# EAGLE design onpoint (EAGLE 7.5.0)
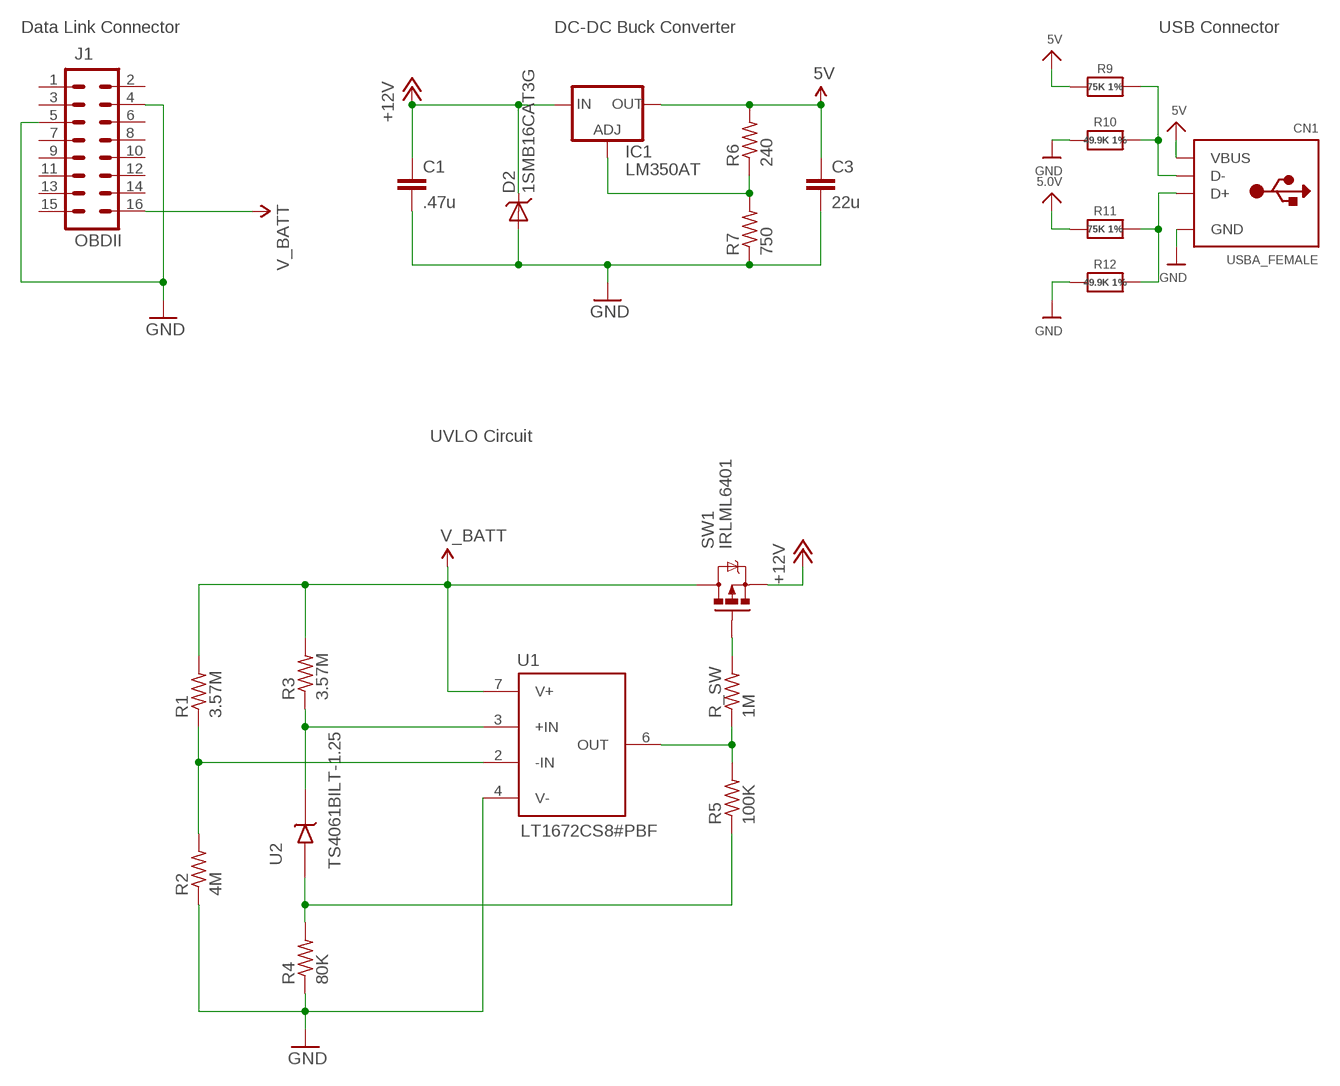
[diagram p0: schematic, sheet 1]

## Parts
C1  .47u  C-EUC0805  [C0805]
C3  22u  C-EUC0805  [C0805]
CN1  USBA_FEMALE  USB_TYPEAPTHFML  [USB_HOST-PTH]
D2  1SMB16CAT3G  DIODE-TVS-SMB  [SMB-DIODE]
IC1  LM350AT  V_REG_MIC2920  [SOT223]
J1  OBDII  M08X2STRAIGHT  [OBDII-STRAIGHT]
R1  3.57M  R-US_R0805  [R0805]
R2  4M  R-US_R0805  [R0805]
R3  3.57M  R-US_R0805  [R0805]
R4  80K  R-US_R0805  [R0805]
R5  100K  R-US_R0805  [R0805]
R6  240  R-US_R0805  [R0805]
R7  750  R-US_R0805  [R0805]
R9  75K 1%  RESISTOR0805_NOOUTLINE  [0805-NO]
R10  49.9K 1%  RESISTOR0805_NOOUTLINE  [0805-NO]
R11  75K 1%  RESISTOR0805_NOOUTLINE  [0805-NO]
R12  49.9K 1%  RESISTOR0805_NOOUTLINE  [0805-NO]
R_SW  1M  R-US_R0805  [R0805]
SW1  IRLML6401  MOSFET-PCHANNELIRLML2244  [SOT23-3]
U1  LT1672CS8#PBF  LT1672CS8#PBFSURFACE_MOUNT  [MSOP8]
U2  TS4061BILT-1.25  [SOT23-3L]

## Nets
5V: C3.1 CN1.VBUS IC1.3(OUT) R6.2 R9.2 R11.2 ; supply symbol labelled 5.0V
+12V: C1.1 D2.C IC1.1(IN) SW1.2(S)
D+: CN1.D+ R11.1 R12.1
D-: CN1.D- R9.1 R10.1
GND: C1.2 C3.2 CN1.GND D2.A J1.4 J1.5 R2.1 R4.1 R7.1 R10.2 R12.2 U1.4(V-)
N$1: IC1.2(GND) R6.1 R7.2
N$2: R5.2 R_SW.1 U1.6(OUT)
N$3: R3.1 U1.3(+IN) U2.1(K)
N$5: R1.1 R2.2 U1.2(-IN)
N$6: R_SW.2 SW1.1(G)
N$7: R4.2 R5.1 U2.2(A)
V_BATT: J1.16 R1.2 R3.2 SW1.3(D) U1.7(V+)
Unconnected: J1.1 J1.2 J1.3 J1.6 J1.7 J1.8 J1.9 J1.10 J1.11 J1.12 J1.13 J1.14 J1.15

## Notes on the sheet
- Data Link Connector | DC-DC Buck Converter | USB Connector
- UVLO Circuit

## Library data of the parts
C1 = rcl:C-EU: CAPACITOR, European symbol; PARTNO: C0805C474K5RACTU
C3 = rcl:C-EU: CAPACITOR, European symbol; PARTNO: GRM219R61A226MEA0D
CN1 = microbuilder:USB_TYPEA: USB - Type A Connectors Male types stick out and are inserted into a PC or matching females parts (these are the connectors used on USB Memory Sticks, etc.). Female parts are generally used for USB Host and accept a male-type connector. SMT - 4UCON: 10017 PTHFML - Digikey: 609-1045-ND, 4UCon: 05241 PCB - Use 2.0mm thick PCBs with this footprint
D2 = BUG:DIODE-TVS; PARTNO: 1SMB16CAT3G; ROLE: Overvoltage protection
IC1 = SparkFun-PowerIC:V_REG_MIC2920: MIC2920A (http://www.micrel.com/_PDF/mic2920.pdf) - 400mA output LDO Regulator
J1 = MuniRent:M08X2: .1" headers, two rows of 8 each; PARTNO: OBD-II
R1-R7 R_SW = rcl:R-US_: RESISTOR, American symbol
R9-R12 = microbuilder:RESISTOR: Resistors For new designs, use the packages preceded by an '_' character since they are more reliable: The following footprints should be used on most boards: _0402 - Standard footprint for regular board layouts _0603 - Standard footprint for regular board layouts _0805 - Standard footprint for regular board layouts _1206 - Standard footprint for regular board layouts For extremely tight-pitch boards where space is at a premium, the following 'micro-pitch' footprints can be used (smaller pads, no silkscreen outline, etc.): _0402MP - Micro-pitch footprint for very dense/compact boards _0603MP - Micro-pitch footprint for very dense/compact boards _0805MP - Micro-pitch footprint for very dense/compact boards _1206MP - Micro-pitch footprint for very dense/compact boards
SW1 = SparkFun-DiscreteSemi:MOSFET-PCHANNEL: Generic PMOSFET IRLML2244 - TRANS-11153 (SOT-23 -20V -4.3A) (1.Gate 2.Source 3.Drain) FQP27P06 - COM-10349 <http://www.sparkfun.com/products/10349> (TO-220 -60V -27A) (1.Gate 2.Source 3.Drain); PROD_ID: TRANS-11153
U1 = alanmond:LT1672CS8#PBF
U2 = alanmond:TS4061BILT-1.25: The TS4061 is a low power and high accuracy shunt voltage reference providing a stable output voltage over the industrial temperature range (-40 to +85 °C), with a maximum temperature coefficient of 35 ppm/°C. It is available in 0.1% and 0.2% initial accuracy versions. The SOT323- 3L and SOT23-3L packages can be designed in applications where space saving is a critical issue. The very low operating current is a key advantage for power restricted designs. The TS4061 is very stable and can be used in a broad range of application conditions.

## Net classes
0 default: width 0.254 mm

## Board
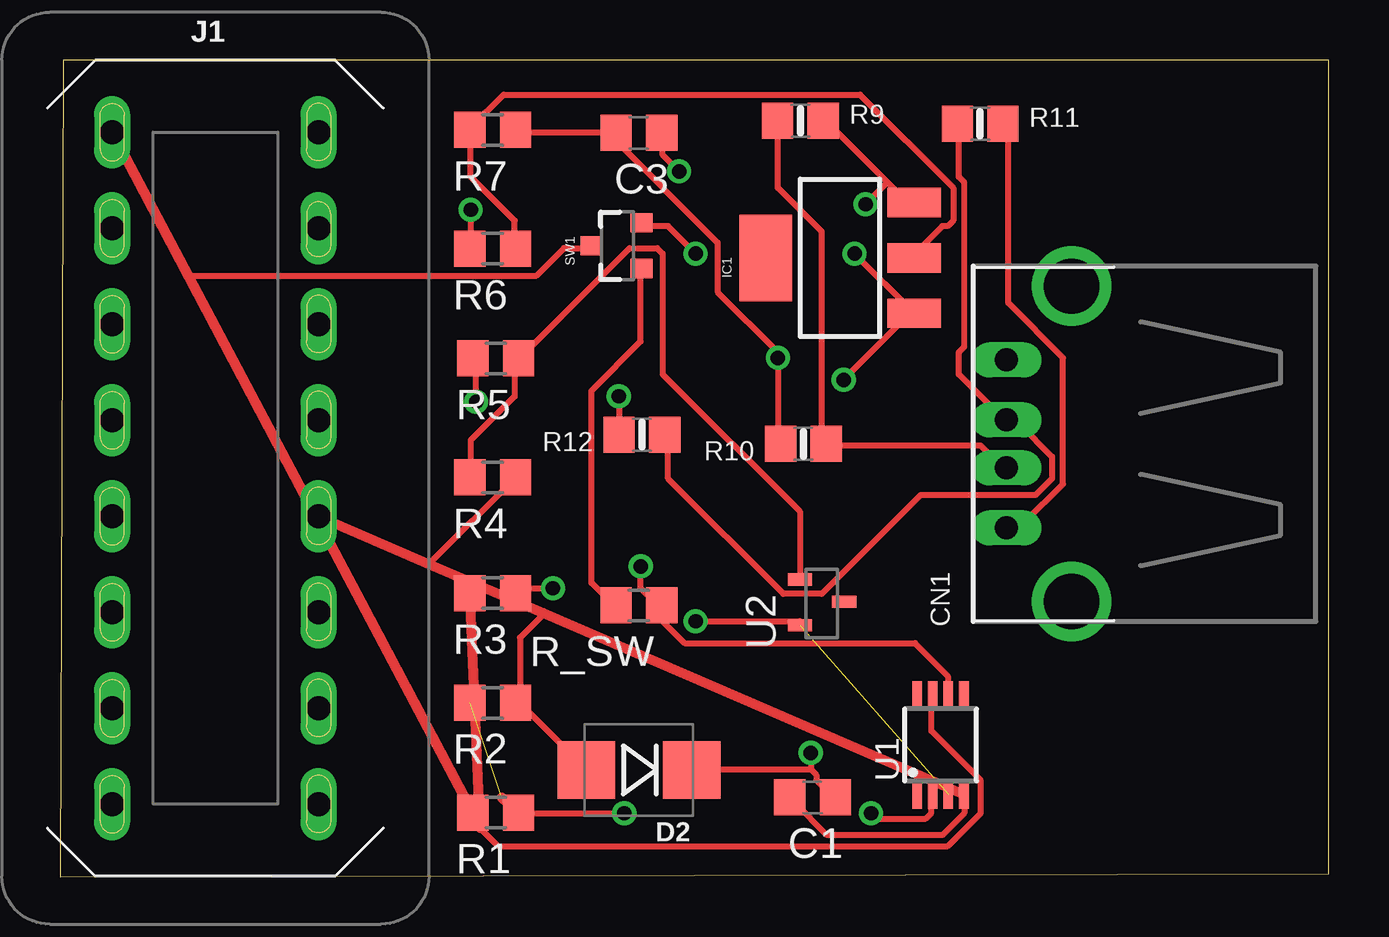
[diagram p1: board, top side]
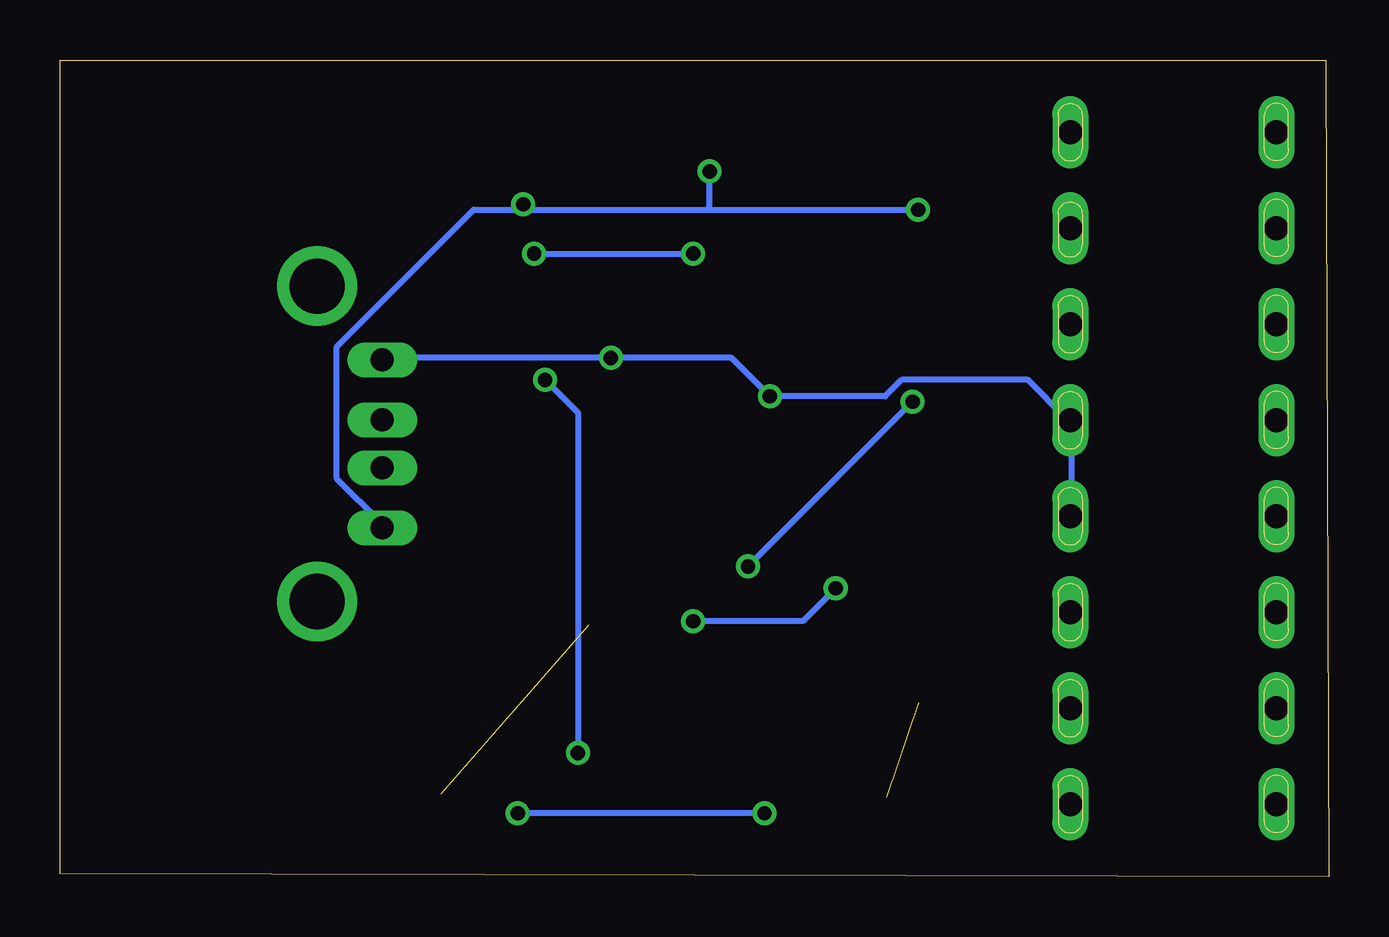
[diagram p2: board, bottom side, seen from below]

Size 52.88 x 34.03 mm. Coordinates in mm from the lower left corner, seen from the top.
Outline: 0,0 52.88,0.13 52.88,34.03 0.13,34.03 0,0
Copper layers (1*16): Top 0.035mm / dielectric 1.5mm / Bottom 0.035mm
Design rules "default": minimum track width 10mil, minimum drill 0.6mm, track to track 8mil, track to pad 8mil, pad to pad 8mil, via to via 8mil, smd to smd 8mil, copper to edge 40mil, drill to drill 8mil, minimum pad ring 10mil, minimum via ring 8mil, stop-mask expansion 4mil, vias tented up to drill 0mil, thermal gap 10mil

### Footprints (pad centres in the part's own frame; a part is rotated, then mirrored left to right if it is on the bottom)
C0805 = smd 1.3 x 1.5: 1 -0.95,0; 2 0.95,0
USB_HOST-PTH = drill 0.95 long: D+ 1,6.52; D- -1,6.52; GND 3.5,6.52; VBUS -3.5,6.52 | drill 2.3 pad 2.9: S1 -6.57,3.81; S2 6.57,3.81
SMB-DIODE = smd 2.4 x 2.4: A 2.2,0; C -2.2,0
SOT223 = smd 1.219 x 2.235: 1 -2.311,-3.099; 2 0,-3.099; 3 2.311,-3.099 | smd 3.6 x 2.2: 4 0,3.099
OBDII-STRAIGHT = drill 1 pad 1.5 long: 1 14,4.3; 2 10,4.3; 3 6,4.3; 4 2,4.3; 5 -2,4.3; 6 -6,4.3; 7 -10,4.3; 8 -14,4.3; 9 14,-4.3; 10 10,-4.3; 11 6,-4.3; 12 2,-4.3; 13 -2,-4.3; 14 -6,-4.3; 15 -10,-4.3; 16 -14,-4.3
R0805 = smd 1.3 x 1.5: 1 -0.95,0; 2 0.95,0
0805-NO = smd 1.3 x 1.5: 1 -0.95,0; 2 0.95,0
SOT23-3 = smd 0.8 x 0.9: 1 -0.95,-1; 2 0.95,-1; 3 0,1.1
MSOP8 = smd 0.4 x 1.2: 1 -0.975,-2.152; 2 -0.325,-2.152; 3 0.325,-2.152; 4 0.975,-2.152; 5 0.975,1.948; 6 0.325,1.948; 7 -0.325,1.948; 8 -0.975,1.948
SOT23-3L = smd 0.508 x 1.016: 1 -0.95,0.907; 2 0.95,0.907; 3 0.025,-0.932

### Placement (x,y rotation side)
C1  31.37,3.3 180 top
C3  24.13,30.99 180 top
CN1  45.97,18.03 90 top
D2  24.13,4.45 180 top
IC1  32.51,25.78 90 top
J1  6.48,17.02 270 top
R1  18.16,2.67 180 top
R2  18.03,7.24 180 top
R3  18.03,11.81 180 top
R4  18.03,16.64 180 top
R5  18.16,21.59 180 top
R6  18.03,26.16 180 top
R7  18.03,31.12 180 top
R9  30.86,31.5 0 top
R10  30.99,18.03 180 top
R11  38.35,31.37 0 top
R12  24.26,18.41 180 top
R_SW  24.13,11.3 180 top
SW1  23.24,26.29 90 top
U1  36.7,5.59 0 top
U2  31.75,11.43 90 top

### Tracks (layer width: path | path; a pad name or v marks a point on that pad's centre or on a via)
5V  (via drill 0.6)
  Top 0.254: 34.49,28.93 35.41,28.02 IC1.3 | 34.49,28.93 31.98,31.45 R9.2 | v17.12,27.79 17.12,26.19 R6.2 | v25.81,29.39 25.12,30.07 25.12,30.99 C3.1 | R11.2 39.52,31.22 39.52,23.9 41.81,21.62 41.81,16.36 40.21,14.76 39.52,14.76 CN1.VBUS | v33.58,28.02 34.49,28.93
  Bottom 0.254: 33.58,27.79 35.64,27.79 41.35,22.07 41.35,16.59 39.52,14.76 CN1.VBUS | 33.58,27.79 25.81,27.79 | 25.81,27.79 v17.12,27.79 | 25.81,27.79 v25.81,29.39 | 33.58,27.79 v33.58,28.02
+12V  (via drill 0.6)
  Top 0.254: 31.29,4.47 31.52,4.24 31.52,4.01 32.21,3.33 C1.1 | 31.29,4.47 26.49,4.47 D2.C | v26.49,25.96 25.35,27.1 24.43,27.1 SW1.2 | v33.12,25.96 IC1.1 35.41,23.44 v32.66,20.7 | v31.29,5.16 31.29,4.47
  Bottom 0.254: v33.12,25.96 v26.49,25.96 | v31.29,5.16 31.29,19.33 v32.66,20.7
D+
  Top 0.254: R12.1 25.35,18.41 25.35,16.59 30.15,11.79 31.75,11.79 35.87,15.9 40.66,15.9 41.35,16.59 41.35,17.5 39.98,18.87 39.52,18.87 CN1.D+ 39.29,19.1 37.47,20.93 37.47,21.84 37.69,22.07 37.69,28.93 37.47,29.16 37.47,31.22 R11.1
D-
  Top 0.254: CN1.D- 39.29,17.04 38.38,17.96 31.98,17.96 R10.1 31.75,18.19 31.75,26.87 29.92,28.7 29.92,31.45 R9.1
GND  (via drill 0.6)
  Top 0.254: 20.14,10.99 20.09,10.87 19.18,9.96 19.18,7.44 R2.1 19.18,7.21 21.92,4.47 D2.A | R4.1 18.95,16.59 15.52,13.16 15.45,13.01 | C1.2 30.61,3.1 31.98,1.73 36.78,1.73 37.69,2.64 37.69,3.33 U1.4 | 22.84,30.99 C3.2 23.06,30.99 | 22.84,30.99 19.18,30.99 R7.1 | 22.84,30.99 27.41,26.42 27.41,24.36 29.92,21.84 v29.92,21.62 29.92,18.19 R10.2 | v23.29,20.02 23.29,18.41 R12.2
  Top 0.406: J1.4 15.45,13.01 20.14,10.99 U1.4
  Bottom 0.254: CN1.GND 39.29,21.62 v29.92,21.62 24.89,21.62 v23.29,20.02 18.49,20.02 17.8,20.7 12.55,20.7 10.95,19.1 J1.5 10.72,18.87 10.72,15.22 J1.4
N$1
  Top 0.254: R6.1 18.95,26.19 18.95,27.33 17.12,29.16 17.12,30.99 R7.2 17.12,31.22 18.49,32.59 33.35,32.59 37.24,28.7 37.24,27.33 37.01,27.1 36.78,27.1 35.64,25.96 IC1.2
N$2  (via drill 0.6)
  Top 0.254: U1.6 37.01,7.67 37.01,8.36 35.64,9.73 26.04,9.73 25.12,10.64 25.12,11.1 R_SW.1 24.89,11.33 24.21,12.01 v24.21,12.93 | v17.35,19.79 17.35,21.39 R5.2
  Bottom 0.254: v24.21,12.93 v17.35,19.79
N$3  (via drill 0.6)  (1 unrouted)
  Top 0.254: v26.49,10.64 30.84,10.64 U2.1 | v20.55,12.01 19.18,12.01 R3.1
  Bottom 0.254: v26.49,10.64 21.92,10.64 v20.55,12.01
N$5  (via drill 0.6)  (1 unrouted)
  Top 0.254: v33.81,2.64 34.04,2.41 36.09,2.41 36.32,2.64 36.32,3.33 U1.2 | v23.52,2.64 19.18,2.64 R1.1
  Top 0.406: R1.1 18.41,3.3
  Bottom 0.254: v23.52,2.64 v33.81,2.64
N$6
  Top 0.254: SW1.1 24.21,25.27 24.21,22.3 22.15,20.24 22.15,12.24 23.06,11.33 R_SW.2
N$7
  Top 0.254: U2.2 30.84,12.47 30.84,15.22 25.12,20.93 25.12,25.96 24.89,26.19 23.75,26.19 19.18,21.62 R5.1 18.95,21.39 18.95,20.02 17.12,18.19 17.12,16.81 R4.2
V_BATT
  Top 0.254: SW1.3 21.92,26.19 21.01,26.19 19.86,25.04 5.46,25.04 5.37,24.99 | U1.7 36.32,7.44 36.32,6.07 38.38,4.01 38.38,2.64 37.01,1.27 18.26,1.27 17.58,1.96 17.53,2.03 | R1.2 17.35,2.64 17.5,2.65
  Top 0.406: J1.16 5.37,24.99 17.53,2.03 17.5,2.65 R3.2